# EasyEDA Pro project tumkibot1_7 ICS43434 I²S Microphone.eprj

# Schematic Schematic1
Board Name: Board1; Create Date: 2025-09-22; Page Name: P1; Project Name: tumkibot1_7 ICS43434 I²S Microphone; Schematic Name: Schematic1; Update Date: 2025-09-22; Company: EasyEDA.com; Page Size: A4; Version: V1.0
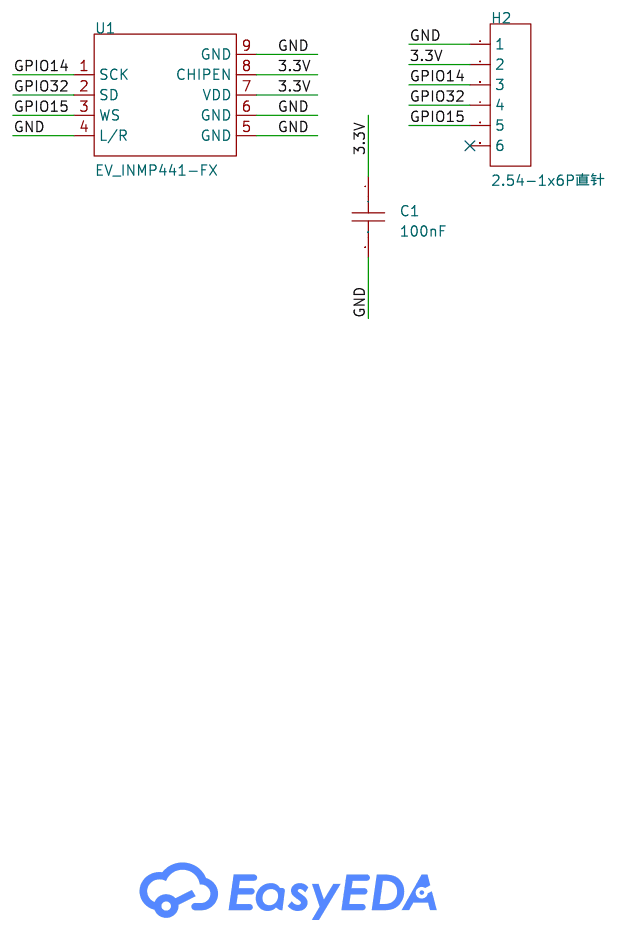
[diagram p0: schematic sheet]

## Parts
C1  100nF  [C0603]
H2  2.54-1x6P直针  [HDR-TH_6P-P2.54-V-M-1]
U1  EV_INMP441-FX  [MID-SMD_L4.7-W3.8_INMP441ACEZ]

## Library data of the parts
C1 = CAP_0603: Supplier Footprint: 0603
H2 = 2.54-1x6P直针: LCSC Part Name: 1x6P 间距:2.54mm 方针 直插; Supplier Part: C37208; Manufacturer: BOOMELE(博穆精密); Supplier Footprint: 插件,P=2.54mm; JLCPCB Part Class: Extended Part; Datasheet: https://atta.szlcsc.com/upload/public/pdf/source/20250115/42A019761A40C8B839643401D8CA5A96.pdf; Supplier: LCSC; Pin Structure: 1x6P; Pitch: 2.54mm; Circluar Pins/Square Pins: Policy; Mounting Type: Straight; Number of Rows: Single Row; Number of Pins: 6P; Current Rating: 3A; Contact Material: Brass; Operating Temperature: -40℃~+105℃; Color: Black
U1 = EV_INMP441-FX: Supplier Part: C17499176; Manufacturer: TDK InvenSense(应美盛); JLCPCB Part Class: Extended Part; Supplier: LCSC; Sensor Type: Audio

## Nets
3.3V: C1.1 H2.2 U1.7(VDD) U1.8(CHIPEN)
GND: C1.2 H2.1 U1.4(L/R) U1.5(GND) U1.6(GND) U1.9(GND)
GPIO14: H2.3 U1.1(SCK)
GPIO15: H2.5 U1.3(WS)
GPIO32: H2.4 U1.2(SD)

Not connected (* = marked no-connect by the designer): H2 6*

# Board PCB1
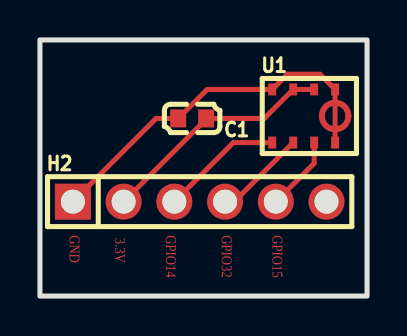
[diagram p1: board, top side]
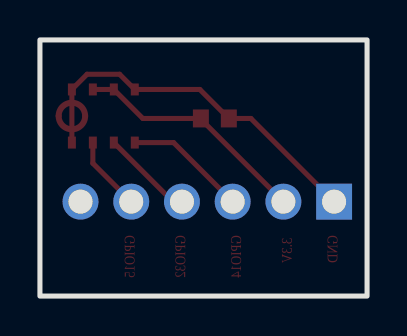
[diagram p2: board, bottom side, seen from below]

Outline 16.38 x 12.83 mm; copper layers: Top Layer, Bottom Layer. Coordinates in mm from the lower left corner of the outline.
Outline path: rectangle 0,12.83 16.38,0
Stack: Top Layer 0.035mm / Dielectric1 1.51mm FR4 er 4.5 / Bottom Layer 0.035mm

## Design rules (mm)
template: JLCPCB Capability(Two Layers Board)
spacing copperThickness1oz (default): track to track 0.102, other pairs 0.152 to 0.3
spacing copperThickness2oz: track to track 0.203, other pairs 0.152 to 0.3
track width copperThickness1oz (default): min 0.127, default 0.254, max 2.54
track width copperThickness2oz: min 0.203, default 0.254, max 2.54
differential pair differentialPair (default): width min 0.127, default 0.254, max 2.54; gap min 0.152, default 0.152
via viaSize (default): diameter min 0.5, default 0.61, max 10; hole min 0.3, default 0.305, max 6.3

## Placement (name value [footprint] x y rotation side)
C1  100nF  [C0603]  7.62 8.89 180 top
H2  2.54-1x6P直针  [HDR-TH_6P-P2.54-V-M-1]  8 4.73 0 top
U1  EV_INMP441-FX  [MID-SMD_L4.7-W3.8_INMP441ACEZ]  13.21 9.02 0 top

## Footprints (pads in the part's own frame, mm; a bottom-side part is the same pattern mirrored in y, then rotated)
C0603
  rect 0.8x0.9 smd: 1(-0.7,0) 2(0.7,0)
HDR-TH_6P-P2.54-V-M-1
  rect 1.8x1.8 hole 1.2: 1(-6.35,0)
  round 1.8 hole 1.2: 2(-3.81,0) 3(-1.27,0) 4(1.27,0) 5(3.81,0) 6(6.35,0)
MID-SMD_L4.7-W3.8_INMP441ACEZ
  rect 0.4x0.6 smd: 1(-1.575,-1.33) 2(-0.525,-1.33) 3(0.525,-1.33) 4(1.575,-1.33) 6(1.575,1.33) 7(0.525,1.33) 8(-0.525,1.33) 9(-1.575,1.33)
  custom 1.626x0.963 smd: 5(1.575,0.664)
  custom 1.626x0.966 smd: 5(1.575,-0.661)

## Nets
As in the schematic.

Pads without a net: H2 6

## Routing (per net, layer and track width the routed paths; a pad name or vN(x,y) marks a point on that pad's centre or on a via; arc(x,y) is an arc through that point)
3.3V: length 11.9
  Top Layer w0.254: H2.2 8.32,8.86 C1.1 11.23,8.89 U1.8 U1.7
GND: length 18.8
  Top Layer w0.254: U1.4 U1.5 U1.5 U1.6 14.02,11.11 12.39,11.11 U1.9 8.38,10.35 C1.2 5.82,8.89 1.65,4.73
GPIO14: length 6.1
  Top Layer w0.254: H2.3 9.69,7.69 U1.1
GPIO15: length 3.8
  Top Layer w0.254: U1.3 13.73,6.65 11.81,4.73
GPIO32: length 4.6
  Top Layer w0.254: 9.27,4.73 9.72,4.73 U1.2

## Text on the board
Top Layer: GND | 3.3V | GPIO14 | GPIO32 | GPIO15
